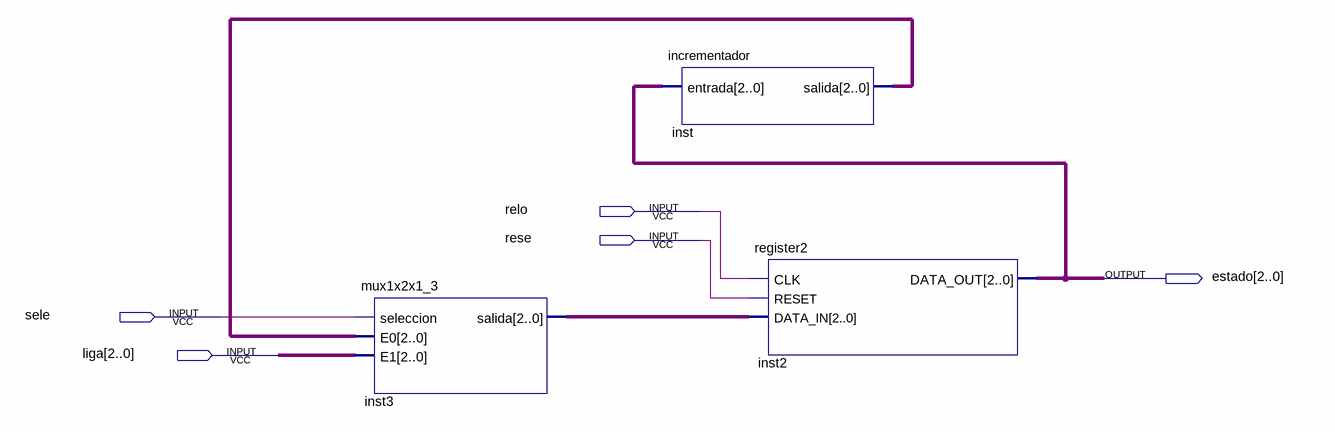
[diagram p0: schematic sheet]
// Quartus schematic contador.bdf as structural Verilog: 3 symbols, 5 pins
module contador (
  input  relo,
  input  rese,
  input  sele,
  input  [2:0] liga,
  output [2:0] estado
);

  wire [2:0] inst3_salida, inst_salida;

  mux1x2x1_3 inst3 (.seleccion(sele), .E0(inst_salida), .E1(liga), .salida(inst3_salida));
  incrementador inst (.entrada(estado), .salida(inst_salida));
  register2 inst2 (.CLK(relo), .RESET(rese), .DATA_IN(inst3_salida), .DATA_OUT(estado));
endmodule
